# EAGLE design sensor_dsp (EAGLE 9.6.2)
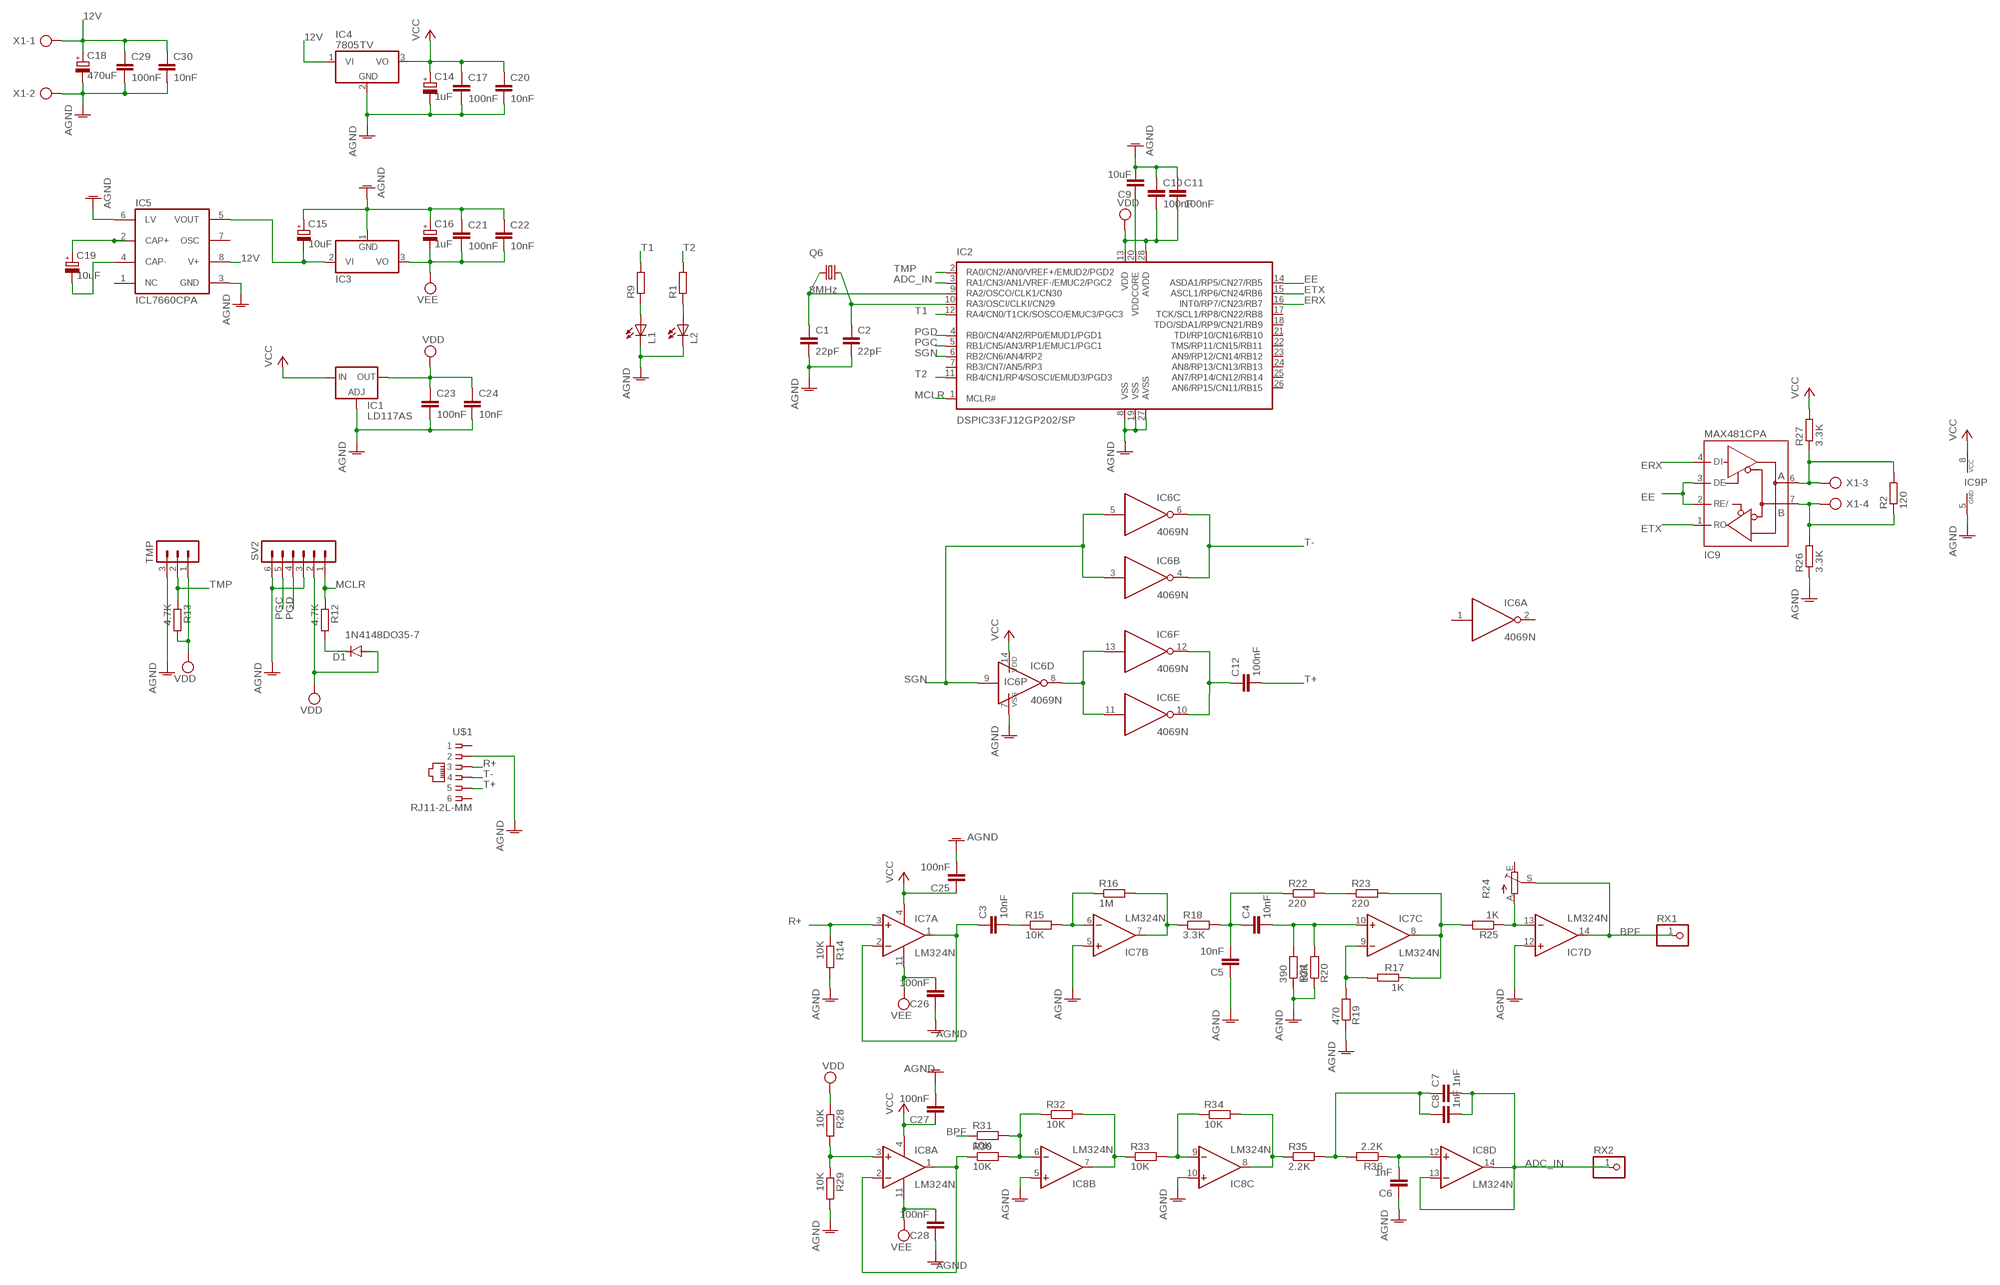
[diagram p0: schematic, sheet 1]

## Parts
C1  22pF  C-EU025-024X044  [C025-024X044]
C2  22pF  C-EU025-024X044  [C025-024X044]
C3  10nF  C5/2.5  [C5B2.5]
C4  10nF  C5/2.5  [C5B2.5]
C5  10nF  C5/2.5  [C5B2.5]
C6  1nF  C5/2.5  [C5B2.5]
C7  1nF  C5/2.5  [C5B2.5]
C8  1nF  C5/2.5  [C5B2.5]
C9  10uF  C-EU050-024X044  [C050-024X044]
C10  100nF  C5/2.5  [C5B2.5]
C11  100nF  C5/2.5  [C5B2.5]
C12  100nF  C5/2.5  [C5B2.5]
C14  1uF  CPOL-EUE2.5-5  [E2,5-5]
C15  10uF  CPOL-EUE2.5-5  [E2,5-5]
C16  1uF  CPOL-EUE2.5-5  [E2,5-5]
C17  100nF  C5/2.5  [C5B2.5]
C18  470uF  CPOL-EUE3.5-8  [E3,5-8]
C19  10uF  CPOL-EUE2.5-5  [E2,5-5]
C20  10nF  C5/2.5  [C5B2.5]
C21  100nF  C5/2.5  [C5B2.5]
C22  10nF  C5/2.5  [C5B2.5]
C23  100nF  C5/2.5  [C5B2.5]
C24  10nF  C5/2.5  [C5B2.5]
C25  100nF  C5/2.5  [C5B2.5]
C26  100nF  C5/2.5  [C5B2.5]
C27  100nF  C5/2.5  [C5B2.5]
C28  100nF  C5/2.5  [C5B2.5]
C29  100nF  C5/2.5  [C5B2.5]
C30  10nF  C5/2.5  [C5B2.5]
D1  1N4148DO35-7  [DO35-7]
IC1  LD117AS  LD117AS12TR  [SOT223]
IC2  DSPIC33FJ12GP202/SP  [DIL28-3]
IC3  79  [TO220V]
IC4  7805TV  [TO220V]
IC5  ICL7660CPA  [DIL08]
IC6  4069N  [DIL14]
IC7  LM324N  [DIL14]
IC8  LM324N  [DIL14]
IC9  MAX481CPA  [DIL08]
L1  LED3MM  [LED3MM]
L2  LED3MM  [LED3MM]
Q6  8MHz  CRYSTALSM49  [SM49]
R1  R-EU_0204/7  [0204/7]
R2  120  R-EU_0204/7  [0204/7]
R9  R-EU_0204/7  [0204/7]
R12  4.7K  R-EU_0204/7  [0204/7]
R13  4.7K  R-EU_0204/7  [0204/7]
R14  10K  R-EU_0204/7  [0204/7]
R15  10K  R-EU_0204/7  [0204/7]
R16  1M  R-EU_0204/7  [0204/7]
R17  1K  R-EU_0204/7  [0204/7]
R18  3.3K  R-EU_0204/7  [0204/7]
R19  470  R-EU_0204/7  [0204/7]
R20  10K  R-EU_0204/7  [0204/7]
R21  390  R-EU_0204/7  [0204/7]
R22  220  R-EU_0204/7  [0204/7]
R23  220  R-EU_0204/7  [0204/7]
R24  TRIM_EU-B64W  [B64W]
R25  1K  R-EU_0204/7  [0204/7]
R26  3.3K  R-EU_0204/7  [0204/7]
R27  3.3K  R-EU_0204/7  [0204/7]
R28  10K  R-EU_0204/7  [0204/7]
R29  10K  R-EU_0204/7  [0204/7]
R30  10K  R-EU_0204/7  [0204/7]
R31  10K  R-EU_0204/7  [0204/7]
R32  10K  R-EU_0204/7  [0204/7]
R33  10K  R-EU_0204/7  [0204/7]
R34  10K  R-EU_0204/7  [0204/7]
R35  2.2K  R-EU_0204/7  [0204/7]
R36  2.2K  R-EU_0204/7  [0204/7]
RX1  PINHD-1X1  [1X01]
RX2  PINHD-1X1  [1X01]
SV2  MA06-1  [MA06-1]
TMP  MA03-1  [MA03-1]
U$1  RJ11-2L-MM  [RJ11-NO_SHIELD_2]
X1  AK300/4  [AK300/4]

## Nets
12V: C18.+ C29.1 C30.1 IC4.1(VI) IC5.8(V+) X1.1
A: IC9.6(A) R2.2 R27.1 X1.3
ADC_IN: C7.2 C8.2 IC2.3(RA1/CN3/AN1/VREF-/EMUC2/PGC2) IC8.13(D:-IN) IC8.14(D:OUT) RX2.1
AGND: C1.2 C2.2 C5.1 C6.1 C9.2 C10.1 C11.1 C14.- C15.+ C16.+ C17.2 C18.- C20.2 C21.1 C22.1 C23.2 C24.2 C25.2 C26.1 C27.2 C28.1 C29.2 C30.2 IC1.1(ADJ) IC2.8(VSS) IC2.19(VSS) IC2.27(AVSS) IC3.1(GND) IC4.2(GND) IC5.3(GND) IC5.6(LV) IC6.7(P:VSS) IC7.5(B:+IN) IC7.12(D:+IN) IC8.5(B:+IN) IC8.10(C:+IN) IC9.5(GND) L1.K(C) L2.K(C) R14.2 R19.1 R20.1 R21.1 R26.1 R29.2 SV2.3 SV2.6 TMP.3 U$1.2 X1.2
B: IC9.7(B) R2.1 R26.2 X1.4
BPF: IC7.14(D:OUT) R24.S R31.1 RX1.1
EE: IC2.14(ASDA1/RP5/CN27/RB5) IC9.2(RE/) IC9.3(DE)
ERX: IC2.16(INT0/RP7/CN23/RB7) IC9.4(DI)
ETX: IC2.15(ASCL1/RP6/CN24/RB6) IC9.1(RO)
MCLR: IC2.1(MCLR#) R12.1 SV2.1
N$1: C9.1 IC2.20(VDDCORE)
N$2: C19.+ IC5.2(CAP+)
N$3: C15.- IC3.2(VI) IC5.5(VOUT)
N$4: C1.1 IC2.9(RA2/OSCO/CLK1/CN30) Q6.1
N$5: C19.- IC5.4(CAP-)
N$6: L1.A R9.1
N$7: C3.1 IC7.1(A:OUT) IC7.2(A:-IN)
N$8: C2.1 IC2.10(RA3/OSCI/CLKI/CN29) Q6.2
N$9: IC7.6(B:-IN) R15.2 R16.1
N$11: D1.C R12.2
N$12: IC6.8(D:O) IC6.11(E:I) IC6.13(F:I)
N$13: C12.1 IC6.10(E:O) IC6.12(F:O)
N$14: IC7.7(B:OUT) R16.2 R18.1
N$15: C3.2 R15.1
N$16: IC7.8(C:OUT) R17.1 R23.2 R25.2
N$17: IC7.9(C:-IN) R17.2 R19.2
N$18: C4.2 IC7.10(C:+IN) R20.2 R21.2
N$19: IC8.1(A:OUT) IC8.2(A:-IN) R30.1
N$20: C4.1 C5.2 R18.2 R22.1
N$21: R22.2 R23.1
N$22: IC7.13(D:-IN) R24.A R25.1
N$23: IC8.3(A:+IN) R28.2 R29.1
N$24: IC8.6(B:-IN) R30.2 R31.2 R32.1
N$25: IC8.7(B:OUT) R32.2 R33.1
N$26: IC8.9(C:-IN) R33.2 R34.1
N$27: IC8.8(C:OUT) R34.2 R35.1
N$28: L2.A R1.1
N$29: C7.1 C8.1 R35.2 R36.2
N$30: C6.2 IC8.12(D:+IN) R36.1
PGC: IC2.5(RB1/CN5/AN3/RP1/EMUC1/PGC1) SV2.5
PGD: IC2.4(RB0/CN4/AN2/RP0/EMUD1/PGD1) SV2.4
R+: IC7.3(A:+IN) R14.1 U$1.3
SGN: IC2.6(RB2/CN6/AN4/RP2) IC6.3(B:I) IC6.5(C:I) IC6.9(D:I)
T1: IC2.12(RA4/CN0/T1CK/SOSCO/EMUC3/PGC3) R9.2
T2: IC2.11(RB4/CN1/RP4/SOSCI/EMUD3/PGD3) R1.2
T+: C12.2 U$1.5
T-: IC6.4(B:O) IC6.6(C:O) U$1.4
TMP: IC2.2(RA0/CN2/AN0/VREF+/EMUD2/PGD2) R13.1 TMP.2
VCC: C14.+ C17.1 C20.1 C25.1 C27.1 IC1.3(IN) IC4.3(VO) IC6.14(P:VDD) IC7.4(P:V+) IC8.4(P:V+) IC9.8(VCC) R27.2
VDD: C10.2 C11.2 C23.1 C24.1 D1.A IC1.4(OUT) IC2.13(VDD) IC2.28(AVDD) R13.2 R28.1 SV2.2 TMP.1
VEE: C16.- C21.2 C22.2 C26.2 C28.2 IC3.3(VO) IC7.11(P:V-) IC8.11(P:V-)
Unconnected: IC2.7(RB3/CN7/AN5/RP3) IC2.17(TCK/SCL1/RP8/CN22/RB8) IC2.18(TDO/SDA1/RP9/CN21/RB9) IC2.21(TDI/RP10/CN16/RB10) IC2.22(TMS/RP11/CN15/RB11) IC2.23(AN9/RP12/CN14/RB12) IC2.24(AN8/RP13/CN13/RB13) IC2.25(AN7/RP14/CN12/RB14) IC2.26(AN6/RP15/CN11/RB15) IC5.1(NC) IC5.7(OSC) IC6.1(A:I) IC6.2(A:O) R24.E U$1.1 U$1.6

## Library data of the parts
C1 C2 C9 = rcl:C-EU: CAPACITOR, European symbol; SPICEPREFIX: C
C3-C8 C10-C12 C17 C20-C30 = capacitor-wima:C: CAPACITOR naming: grid - package width
C14-C16 C18 C19 = rcl:CPOL-EU: POLARIZED CAPACITOR, European symbol; SPICEPREFIX: C
D1 = diode:1N4148: DIODE high speed (Philips)
IC1 = v-reg:LD117A?*: Low drop fixed and adjustable positive voltage regulators 1 A Source: http://www.st.com/stonline/products/literature/ds/7194/ld1117axx.pdf
IC2 = microchip-dspic:DSPIC33FJ12GP202: dsPIC33 General DSC
IC3 = linear:79*: Negative VOLTAGE REGULATOR
IC4 = linear:78*: Positive VOLTAGE REGULATOR Source: http://cache.national.com/ds/LM/LM78L05.pdf http://www.fairchildsemi.com/ds/LM/LM7805.pdf
IC5 = maxim:ICL7660CPA: VOLTAGE CONVERTER; MF: INTERSIL; MPN: ICL7660CPA; OC_FARNELL: 1018170; OC_NEWARK: 06F7441
IC6 = 40xx:4069: Hex INVERTER
IC7 IC8 = linear:LM324: OP AMP
IC9 = maxim:MAX481CPA: RS485 TRANSEIVER; MPN: MAX481CPA+; OC_FARNELL: unknown; OC_NEWARK: 99K3445
L1 L2 = led:LED: LED OSRAM: - CHIPLED LG R971, LG N971, LY N971, LG Q971, LY Q971, LO R971, LY R971 LH N974, LH R974 LS Q976, LO Q976, LY Q976 LO Q996 - Hyper CHIPLED LW Q18S LB Q993, LB Q99A, LB R99A - SideLED LS A670, LO A670, LY A670, LG A670, LP A670 LB A673, LV A673, LT A673, LW A673 LH A674 LY A675 LS A676, LA A676, LO A676, LY A676, LW A676 LS A679, LY A679, LG A679 - Hyper Micro SIDELED® LS Y876, LA Y876, LO Y876, LY Y876 LT Y87S - SmartLED LW L88C, LW L88S LB L89C, LB L89S, LG L890 LS L89K, LO L89K, LY L89K LS L896, LA L896, LO L896, LY L896 - TOPLED LS T670, LO T670, LY T670, LG T670, LP T670 LSG T670, LSP T670, LSY T670, LOP T670, LYG T670 LG T671, LOG T671, LSG T671 LB T673, LV T673, LT T673, LW T673 LH T674 LS T676, LA T676, LO T676, LY T676, LB T676, LH T676, LSB T676, LW T676 LB T67C, LV T67C, LT T67C, LS T67K, LO T67K, LY T67K, LW E67C LS E67B, LA E67B, LO E67B, LY E67B, LB E67C, LV E67C, LT E67C LW T67C LS T679, LY T679, LG T679 LS T770, LO T770, LY T770, LG T770, LP T770 LB T773, LV T773, LT T773, LW T773 LH T774 LS E675, LA E675, LY E675, LS T675 LS T776, LA T776, LO T776, LY T776, LB T776 LHGB T686 LT T68C, LB T68C - Hyper Mini TOPLED® LB M676 - Mini TOPLED Santana® LG M470 LS M47K, LO M47K, LY M47K Source: http://www.osram.convergy.de LUXEON: - LUMILED® LXK2-PW12-R00, LXK2-PW12-S00, LXK2-PW14-U00, LXK2-PW14-V00 LXK2-PM12-R00, LXK2-PM12-S00, LXK2-PM14-U00 LXK2-PE12-Q00, LXK2-PE12-R00, LXK2-PE12-S00, LXK2-PE14-T00, LXK2-PE14-U00 LXK2-PB12-K00, LXK2-PB12-L00, LXK2-PB12-M00, LXK2-PB14-N00, LXK2-PB14-P00, LXK2-PB14-Q00 LXK2-PR12-L00, LXK2-PR12-M00, LXK2-PR14-Q00, LXK2-PR14-R00 LXK2-PD12-Q00, LXK2-PD12-R00, LXK2-PD12-S00 LXK2-PH12-R00, LXK2-PH12-S00 LXK2-PL12-P00, LXK2-PL12-Q00, LXK2-PL12-R00 Source: www.luxeon.com KINGBRIGHT: KA-3528ASYC Source: www.kingbright.com
Q6 = crystal:CRYSTAL: CRYSTAL; OC_FARNELL: unknown; OC_NEWARK: unknown
R1 R2 R9 R12 R13 R15-R17 R19-R23 R25-R29 R31-R36 = rcl:R-EU_: RESISTOR, European symbol; SPICEPREFIX: R
R14 R30 = rcl:R-EU_: RESISTOR, European symbol
R18 = resistor:R-EU_: RESISTOR, European symbol
R24 = pot:TRIM_EU-: POTENTIOMETER
RX1 RX2 = pinhead:PINHD-1X1: PIN HEADER
SV2 = con-lstb:MA06-1: PIN HEADER; OC_FARNELL: unknown; OC_NEWARK: unknown
TMP = con-lstb:MA03-1: PIN HEADER; OC_FARNELL: unknown; OC_NEWARK: unknown
U$1 = RJ11_RSA:RJ11-2L-MM
X1 = con-ptr500:AK300/4: CONNECTOR; OC_FARNELL: unknown; OC_NEWARK: unknown

## Board
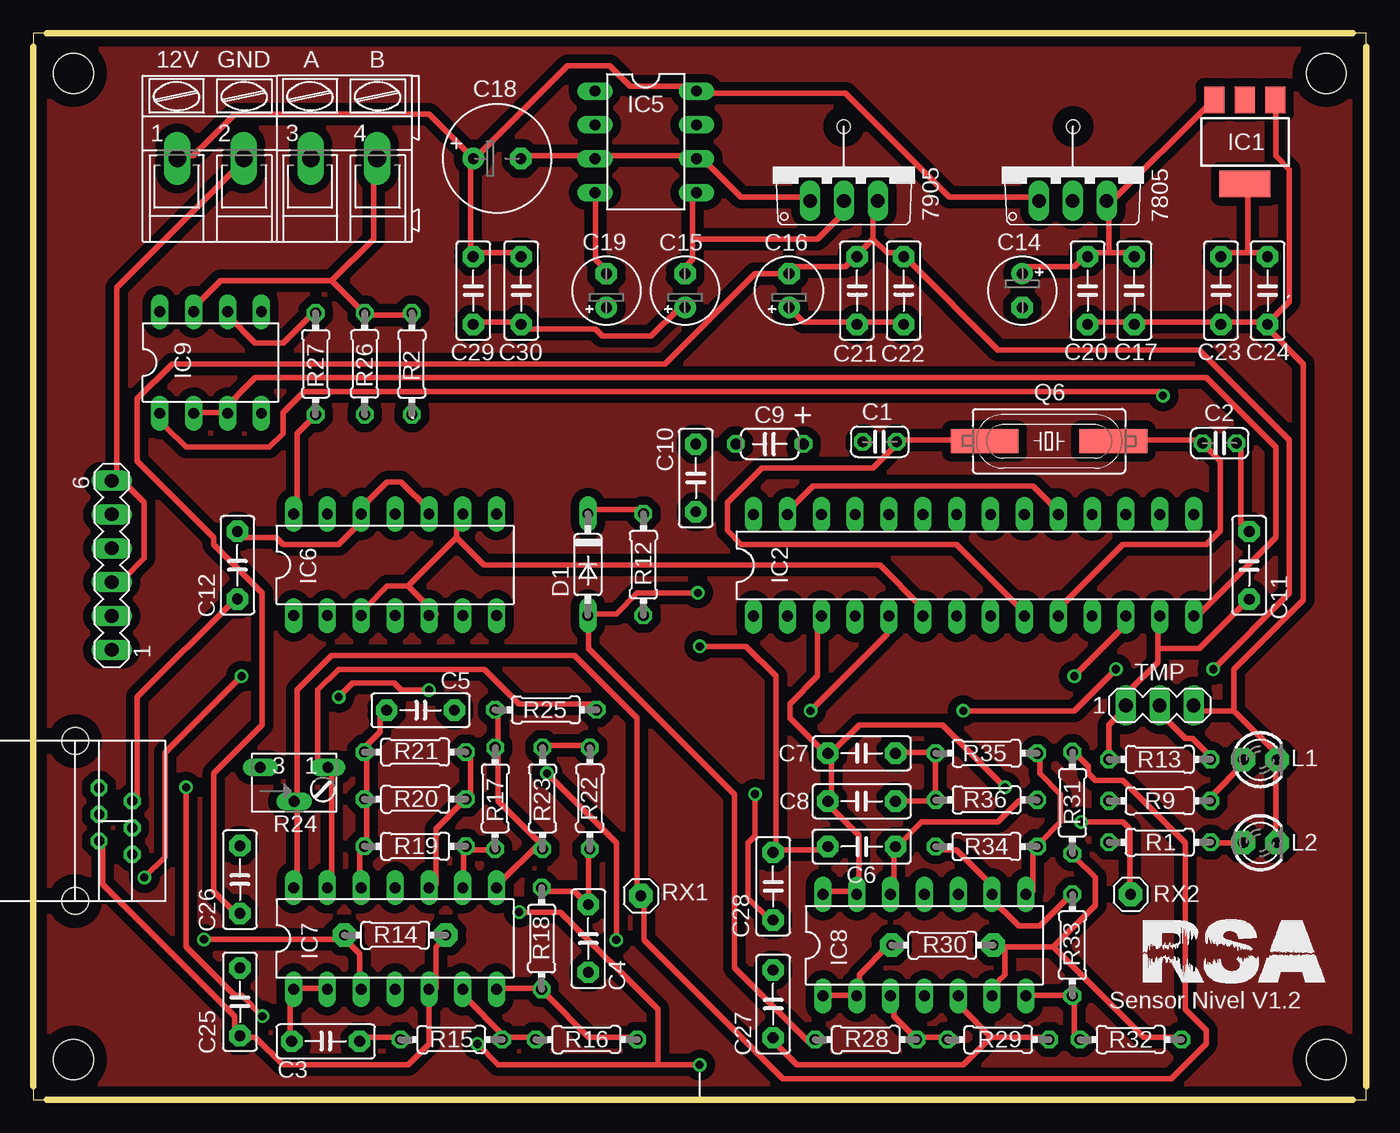
[diagram p1: board, top side]
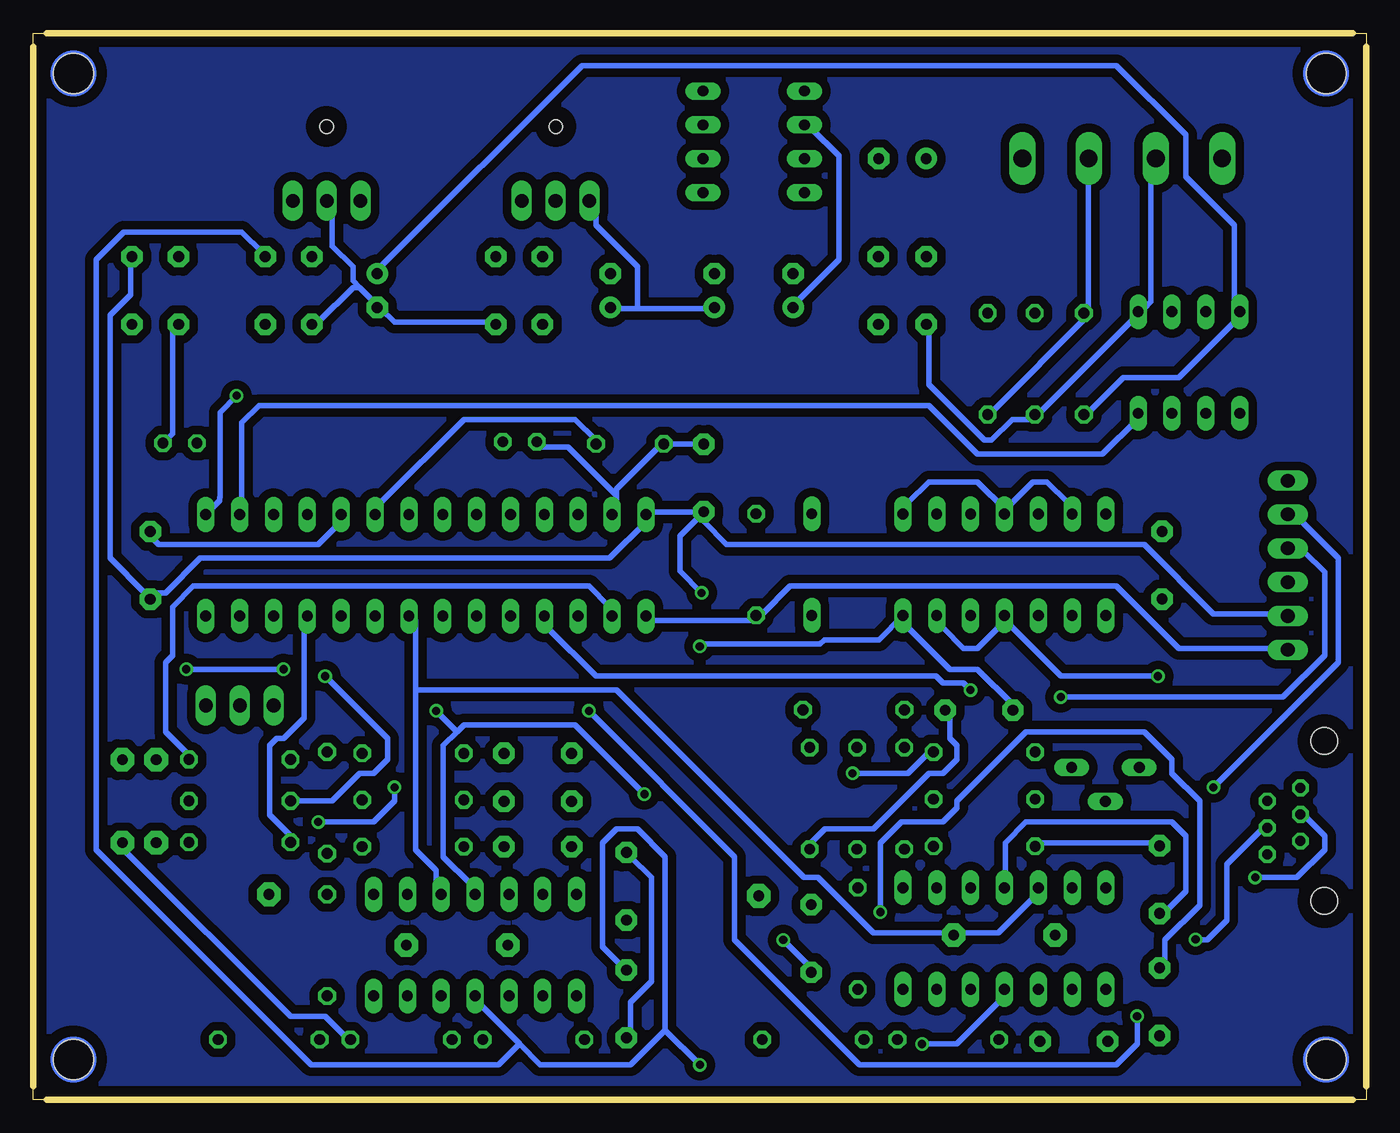
[diagram p2: board, bottom side, seen from below]

Size 100 x 80 mm. Coordinates in mm from the lower left corner, seen from the top.
Outline: 0,0 100,0 100,80 0,80 0,0
Copper layers (1*16): Top 0.035mm / dielectric 1.5mm / Bottom 0.035mm
Design rules "default *": minimum track width 16mil, minimum drill 24mil, track to track 25mil, track to pad 25mil, pad to pad 25mil, via to via 25mil, smd to smd 8mil, copper to edge 40mil, drill to drill 25mil, minimum pad ring 10mil, minimum via ring 8mil, stop-mask expansion 4mil, vias tented up to drill 0mil, thermal gap 10mil
Holes 3 mm at 3,77 97,77 97,3 3,3
Holes 1 mm at 60.8,73 78,73
Milling: 4 lines

### Footprints (pad centres in the part's own frame; a part is rotated, then mirrored left to right if it is on the bottom)
C025-024X044 = drill 0.813 octagon: 1 -1.27,0; 2 1.27,0
C5B2.5 = drill 0.813 pad 1.6 octagon: 1 -2.54,0; 2 2.54,0
C050-024X044 = drill 0.813 octagon: 1 -2.54,0; 2 2.54,0
E2,5-5 = drill 0.813 pad 1.6: + -1.27,0 | drill 0.813 pad 1.6 octagon: - 1.27,0
E3,5-8 = drill 0.813 pad 1.6: + -1.778,0 | drill 0.813 pad 1.6 octagon: - 1.778,0
DO35-7 = drill 0.813 long: A 3.81,0; C -3.81,0
SOT223 = smd 1.5 x 2: 1 -2.3,-3.15; 2 0,-3.15; 3 2.3,-3.15 | smd 3.8 x 2: 4 0,3.15
DIL28-3 = drill 0.813 long: 1 -16.51,-3.81; 2 -13.97,-3.81; 3 -11.43,-3.81; 4 -8.89,-3.81; 5 -6.35,-3.81; 6 -3.81,-3.81; 7 -1.27,-3.81; 8 1.27,-3.81; 9 3.81,-3.81; 10 6.35,-3.81; 11 8.89,-3.81; 12 11.43,-3.81; 13 13.97,-3.81; 14 16.51,-3.81; 15 16.51,3.81; 16 13.97,3.81; 17 11.43,3.81; 18 8.89,3.81; 19 6.35,3.81; 20 3.81,3.81; 21 1.27,3.81; 22 -1.27,3.81; 23 -3.81,3.81; 24 -6.35,3.81; 25 -8.89,3.81; 26 -11.43,3.81; 27 -13.97,3.81; 28 -16.51,3.81
TO220V = drill 1.016 long: 1 -2.54,-2.54; 2 0,-2.54; 3 2.54,-2.54
DIL08 = drill 0.813 long: 1 -3.81,-3.81; 2 -1.27,-3.81; 3 1.27,-3.81; 4 3.81,-3.81; 5 3.81,3.81; 6 1.27,3.81; 7 -1.27,3.81; 8 -3.81,3.81
DIL14 = drill 0.813 long: 1 -7.62,-3.81; 2 -5.08,-3.81; 3 -2.54,-3.81; 4 0,-3.81; 5 2.54,-3.81; 6 5.08,-3.81; 7 7.62,-3.81; 8 7.62,3.81; 9 5.08,3.81; 10 2.54,3.81; 11 0,3.81; 12 -2.54,3.81; 13 -5.08,3.81; 14 -7.62,3.81
LED3MM = drill 0.8 pad 1.778 octagon: A -1.27,0; K 1.27,0
SM49 = smd 5.08 x 1.778: 1 -4.826,0; 2 4.826,0
0204/7 = drill 0.813 octagon: 1 -3.81,0; 2 3.81,0
0204/7' = drill 0.8 pad 1.778 octagon: 1 -3.81,0; 2 3.81,0
B64W = drill 0.813 long: A 2.54,0; E -2.54,0; S 0,-2.54
1X01 = drill 0.8 pad 1.778 octagon: 1 0,0
MA06-1 = drill 1.016 long: 1 -6.35,0; 2 -3.81,0; 3 -1.27,0; 4 1.27,0; 5 3.81,0; 6 6.35,0
MA03-1 = drill 1.016 long: 1 -2.54,0; 2 0,0; 3 2.54,0
RJ11-NO_SHIELD_2 = drill 0.75 octagon: 1 -2.5,-7.3; 2 -1.5,-4.8; 3 -0.5,-7.3; 4 0.5,-4.8; 5 1.5,-7.3; 6 2.5,-4.8 | hole 2: -6,-3; 6,-3
AK300/4 = drill 1.321 long: 1 -7.493,0; 2 -2.515,0; 3 2.515,0; 4 7.493,0

### Placement (x,y rotation side)
C1  63.5,49.35 180 top
C2  89,49.25 0 top
C3  21.93,4.37 0 top
C4  41.63,12.08 270 top
C5  29.05,29.21 0 top
C6  62.15,18.98 0 top
C7  62.15,25.98 180 top
C8  62.15,22.38 180 top
C9  55.24,49.19 180 top
C10  49.7,46.63 270 top
C11  91.22,40.08 270 top
C12  15.31,40.09 270 top
C14  74.2,60.7 270 top
C15  48.9,60.7 90 top
C16  56.7,60.7 90 top
C17  82.6,60.7 270 top
C18  34.79,70.6 0 top
C19  43,60.7 90 top
C20  79.1,60.7 270 top
C21  61.8,60.7 90 top
C22  65.3,60.7 90 top
C23  89.1,60.7 270 top
C24  92.6,60.7 270 top
C25  15.5,7.33 270 top
C26  15.5,16.5 270 top
C27  55.5,7.17 270 top
C28  55.5,16 270 top
C29  33,60.7 270 top
C30  36.6,60.7 270 top
D1  41.6,40.13 270 top
IC1  90.9,71.86 180 top
IC2  70.55,40.08 0 top
IC3  60.82,69.98 0 top
IC4  77.99,69.98 0 top
IC5  45.95,71.86 270 top
IC6  27.14,40.12 0 top
IC7  27.14,12.08 0 top
IC8  66.86,11.58 0 top
IC9  13.3,55.3 0 top
L1  92.05,25.5 0 top
L2  92.05,19.27 0 top
Q6  76.2,49.4 0 top
R1  84.51,19.3 180 top
R2  28.4,55.2 270 top
R9  84.51,22.41 180 top
R12  45.77,40.13 90 top
R13  84.51,25.52 180 top
R14  10K  [0204/7']  27.15,12.33 0 top
R15  31.36,4.5 0 top
R16  41.5,4.5 0 top
R17  34.65,22.6 270 top
R18  38.14,12.08 90 top
R19  28.65,19 0 top
R20  28.65,22.54 0 top
R21  28.65,26.07 0 top
R22  41.75,22.6 90 top
R23  38.2,22.6 270 top
R24  19.57,24.92 0 top
R25  38.45,29.24 180 top
R26  24.86,55.2 90 top
R27  21.18,55.2 270 top
R28  62.46,4.5 0 top
R29  72.4,4.5 0 top
R30  10K  [0204/7']  68.21,11.58 0 top
R31  77.96,22.27 270 top
R32  82.33,4.5 180 top
R33  77.96,11.58 90 top
R34  71.52,18.98 0 top
R35  71.52,25.98 180 top
R36  71.52,22.48 180 top
RX1  45.58,15.29 0 top
RX2  82.33,15.4 0 top
SV2  5.88,40.09 90 top
TMP  84.51,29.57 0 top
U$1  0.13,20.89 90 top
X1  18.3,70.6 0 top

### Tracks (layer width: path | path; a pad name or v marks a point on that pad's centre or on a via)
12V
  Top 0.406: C30.1 36.45,63.52 33.33,63.52 C29.1 32.8,63.52 32.8,70.29 C18.+ | C18.+ 33.33,70.81 40.09,77.58 43.22,77.58 44.78,76.02 49.47,76.02 IC5.8 49.99,75.5 60.92,75.5 68.73,67.69 74.98,67.69 IC4.1 | X1.1 10.94,70.81 11.98,70.81 15.1,73.94 29.68,73.94 32.8,70.81 C18.+
A
  Top 0.406: IC9.6 14.58,58.84 16.66,56.76 18.75,56.76 20.83,58.84 R27.1
  Bottom 0.406: R2.2 28.12,51.55 20.83,58.84 R27.1 20.83,59.36 20.83,70.29 X1.3
ADC_IN  (via drill 0.61)
  Top 0.406: 61.44,15.62 61.94,15.62 61.94,19.81 59.88,21.87 C8.2 59.88,22.39 59.88,25.51 C7.2 | 61.44,15.62 59.36,15.62 IC8.14 | IC2.3 58.84,35.93 58.84,31.76 56.76,29.68 56.76,28.64 59.36,26.04 C7.2 | 61.44,15.62 IC8.13 | v78.63,20.83 81.75,20.83 82.27,20.31 82.27,15.62 RX2.1 | v72.9,23.43 68.21,28.12 61.96,28.12 59.88,26.04 C7.2
  Bottom 0.406: v78.63,20.83 74.46,20.83 72.9,22.39 v72.9,23.43
AGND  (via drill 0.61)
  Top 0.406: 90.08,29.16 87.48,29.16 TMP.3 | 90.08,29.16 93.73,25.51 L1.K 93.2,24.99 93.2,19.79 L2.K | 71.86,4.69 69.77,6.77 69.77,7.29 IC8.5 | 71.86,4.69 76.02,4.69 R29.2 | 55.72,18.75 59.36,18.75 C6.1 | 71.86,4.69 69.77,2.6 57.28,2.6 55.72,4.17 C27.2 | U$1.2 5.21,19.27 5.21,16.14 15.1,6.25 15.1,5.21 C25.2 15.62,4.69 16.66,4.69 18.75,2.6 28.12,2.6 29.68,4.17 29.68,7.81 IC7.5 30.2,8.33 30.2,11.46 30.72,11.98 R14.2 | IC7.12 24.47,16.14 24.47,18.75 R19.1 24.99,19.27 24.99,22.39 R20.1 24.99,22.91 24.99,26.04 R21.1 24.99,26.56 26.04,27.6 26.04,29.16 C5.1 | 55.72,18.75 55.72,31.76 53.48,34 v50,34 | 55.72,18.75 C28.1 | 6.25,46.86 8.33,44.78 8.33,40.62 6.77,39.05 6.25,39.05 SV2.3 | 6.25,46.86 6.25,60.92 15.62,70.29 X1.2 | 6.25,46.86 SV2.6 | C18.- 36.97,70.81 41.66,70.81 IC5.3 42.18,70.81 49.47,70.81 IC5.6 49.99,70.81 53.11,67.69 57.8,67.69 IC3.1 | C29.2 33.33,58.32 36.45,58.32 C30.2 36.97,57.8 42.18,57.8 42.7,57.28 46.34,57.28 48.42,59.36 C15.+ | C22.1 65.09,58.32 61.96,58.32 C21.1 61.44,58.32 57.8,58.32 56.76,59.36 C16.+ | C20.2 79.15,58.32 82.27,58.32 C17.2 82.79,58.32 89.04,58.32 C23.2 89.56,58.32 92.16,58.32 C24.2 | IC1.1 93.2,74.98 93.2,70.81 94.25,69.77 94.25,59.88 92.69,58.32 C24.2 | C2.2 90.6,48.95 90.6,43.22 91.12,42.7 C11.1 | 90.08,29.16 90.08,32.28 95.29,37.49 95.29,55.19 92.69,57.8 C24.2 | IC2.19 76.9,44.13 74.98,46.05 58.5,46.05 56.62,44.17 56.62,44.43 56.58,44.39 IC2.27
  Bottom 0.406: C27.2 55.19,4.69 55.19,7.29 53.63,8.85 53.63,16.66 55.19,18.22 C28.1 | L2.K 93.2,19.27 93.2,18.75 80.71,6.25 78.11,6.25 76.54,4.69 R29.2 | C5.1 26.56,29.68 29.16,32.28 31.24,32.28 34.37,35.41 34.37,35.93 IC6.7 36.57,34.5 40.65,34.5 40.98,34.17 49.83,34.17 v50,34 | 71.34,30.72 71.34,35.93 IC2.8 | 71.34,30.72 71.34,18.75 69.77,17.18 69.77,15.62 IC8.10 | C26.1 15.62,19.27 24.47,19.27 R19.1 | IC7.12 24.47,15.62 27.6,12.5 30.72,12.5 R14.2 31.24,12.5 36.97,12.5 41.13,16.66 42.18,16.66 56.24,30.72 71.34,30.72 | X1.2 16.14,70.29 16.14,59.88 16.66,59.36 IC9.5 17.18,58.84 24.47,51.55 R26.1 24.99,51.03 26.56,51.03 28.12,49.47 28.64,49.47 32.8,53.63 32.8,57.8 C29.2 | 54.67,59.36 56.24,59.36 C16.+ | 54.67,59.36 48.95,59.36 C15.+ | 54.67,59.36 54.67,62.48 57.8,65.61 57.8,67.17 IC3.1 | 75.5,60.92 74.46,59.88 C14.- 73.94,59.36 72.9,58.32 65.61,58.32 C22.1 | 75.5,60.92 76.02,61.44 76.02,62.48 77.58,64.05 77.58,67.17 IC4.2 | 75.5,60.92 76.02,60.92 78.63,58.32 C20.2 | 56.24,45.3 56.24,45.82 53.11,48.95 C9.2 49.72,49.19 C10.1 | 56.24,45.3 56.24,44.26 IC2.27 | 56.24,45.3 59.88,48.95 61.96,48.95 C1.2 | IC2.19 77.06,43.74 77.06,43.22 78.63,41.66 90.6,41.66 91.12,42.18 C11.1 | C23.2 89.56,57.8 89.56,49.99 90.08,49.47 C2.2
B
  Top 0.406: R2.1 28.12,58.84 24.99,58.84 R26.2 24.47,59.36 22.39,61.44 | 22.39,61.44 14.06,61.44 12.5,59.88 12.5,59.36 IC9.7 | 22.39,61.44 25.51,64.57 25.51,70.29 X1.4
BPF
  Top 0.406: IC7.14 19.79,16.14 19.79,21.87 R24.S 19.79,22.39 19.79,30.72 22.39,33.33 40.62,33.33 45.3,28.64 45.3,15.62 RX1.1 45.82,15.1 45.82,11.98 56.24,1.56 85.39,1.56 88,4.17 88,5.21 86.44,6.77 86.44,19.27 81.75,23.95 79.67,23.95 79.15,24.47 79.15,24.99 78.11,26.04 R31.1
EE
  Top 0.406: 14.06,51.55 12.5,51.55 IC9.2 | 14.06,51.55 16.66,54.15 88,54.15 93.2,48.95 93.2,42.18 87.48,36.45 IC2.14 | 14.06,51.55 IC9.3
ERX
  Bottom 0.406: IC2.16 84.35,44.26 84.35,50.78 83.06,52.07 32.8,52.07 29.16,48.42 19.79,48.42 17.18,51.03 IC9.4
ETX  (via drill 0.61)
  Top 0.406: IC9.1 9.89,51.03 9.89,50.51 11.46,48.95 17.7,48.95 18.75,49.99 18.75,51.55 20.31,53.11 84.44,53.11 v84.75,52.81
  Bottom 0.406: IC2.15 86.02,44.93 86.02,45.17 86,45.19 86,51.56 v84.75,52.81
MCLR
  Bottom 0.406: IC2.1 53.63,35.93 45.82,35.93 R12.1 45.3,36.45 43.22,38.53 18.75,38.53 14.06,33.85 6.25,33.85 SV2.1
MM1
  pour Top: 0,0 99.9,0 99.9,80 0,80
N$1
  Bottom 0.406: IC2.20 73.94,44.26 73.94,44.78 67.69,51.03 59.36,51.03 57.8,49.47 C9.1
N$2
  Bottom 0.406: IC5.2 41.66,72.9 39.57,70.81 39.57,63.01 42.7,59.88 C19.+
N$3
  Top 0.406: 49.47,64.57 49.47,63.01 48.95,62.48 C15.- | 49.47,64.57 49.47,67.69 IC5.5 | 49.47,64.57 58.84,64.57 60.4,66.13 60.4,67.17 IC3.2
N$4
  Top 0.406: IC2.9 73.94,36.45 73.94,36.97 69.25,41.66 53.11,41.66 52.07,42.7 52.07,44.78 54.67,47.38 63.01,47.38 64.57,48.95 C1.1 65.09,49.47 71.34,49.47 Q6.1
N$5
  Top 0.406: IC5.4 42.18,67.69 42.18,63.01 42.7,62.48 C19.-
N$6
  Top 0.406: R9.1 88.52,22.91 90.6,24.99 L1.A
N$7
  Top 0.406: IC7.2 21.87,8.33 19.79,8.33 IC7.1 19.27,7.81 19.27,4.69 C3.1
N$8
  Top 0.406: IC2.10 77.06,36.45 77.06,36.97 81.75,41.66 88,41.66 89.04,42.7 89.04,47.9 88,48.95 C2.1 87.48,49.47 81.23,49.47 Q6.2
N$9
  Top 0.406: 35.41,4.69 37.49,4.69 R16.1 | 35.41,4.69 32.28,7.81 IC7.6 | 35.41,4.69 R15.2
N$10
  pour Bottom: 0,80 100,80 100,0 0,0
N$11
  Top 0.406: D1.C 41.66,44.26 45.3,44.26 R12.2
N$12
  Bottom 0.406: 27.08,44.26 24.99,46.34 23.95,46.34 22.39,44.78 22.39,44.26 IC6.13 | 27.08,44.26 29.16,46.34 32.8,46.34 34.37,44.78 34.37,44.26 IC6.8 | 27.08,44.26 IC6.11
N$13
  Top 0.406: IC6.10 29.68,44.26 27.6,46.34 26.56,46.34 24.99,44.78 24.99,44.26 IC6.12 24.99,43.74 22.91,41.66 18.75,41.66 18.22,42.18 15.62,42.18 C12.1
N$14
  Top 0.406: IC7.7 34.89,8.33 38.01,8.33 R18.1 38.53,7.81 41.66,4.69 45.3,4.69 R16.2
N$15
  Top 0.406: R15.1 27.08,4.69 24.99,4.69 C3.2
N$16
  Top 0.406: R25.2 34.89,29.16 34.89,26.56 R17.1 34.89,26.04 34.89,22.39 38.01,19.27 | 38.01,19.27 34.89,16.14 IC7.8 | 38.01,19.27 R23.2
N$17
  Top 0.406: IC7.9 32.28,16.14 32.28,18.75 R19.2 32.8,18.75 34.37,18.75 R17.2
N$18  (via drill 0.61)
  Top 0.406: IC7.10 30.2,16.14 30.2,20.31 32.28,22.39 R20.2 32.8,22.91 32.8,26.04 R21.2 | v43.74,11.98 43.74,19.27 v38.53,24.47
  Bottom 0.406: v43.74,11.98 41.66,9.89 C4.2 | v38.53,24.47 34.37,24.47 32.8,26.04 R21.2
N$19
  Top 0.406: IC8.1 59.36,7.81 61.44,7.81 IC8.2 61.96,7.81 61.96,9.37 64.05,11.46 R30.1
N$20
  Top 0.406: R18.2 38.53,15.62 40.62,15.62 41.13,15.1 C4.1 41.66,15.1 41.66,18.75 R22.1
  Bottom 0.406: C5.2 31.24,29.16 31.24,27.08 30.72,26.56 30.72,25.51 31.76,24.47 32.8,24.47 36.97,20.31 40.62,20.31 41.66,19.27 R22.1
N$21
  Top 0.406: R23.1 38.53,26.56 41.66,26.56 R22.2
N$22
  Top 0.406: IC7.13 22.39,16.14 22.39,24.47 R24.A 21.87,24.99 21.35,25.51 21.35,30.72 22.91,32.28 33.85,32.28 36.45,29.68 42.18,29.68 R25.1
N$23
  Top 0.406: R29.1 68.21,4.69 66.65,4.69 R28.2 66.13,4.69 64.57,6.25 64.57,7.29 IC8.3
N$24
  Top 0.406: 76.54,11.46 83.31,4.69 85.92,4.69 R32.1 | 72.9,11.46 72.38,11.46 R30.2 72.9,11.46 | 72.9,11.46 76.54,11.46 | 72.9,11.46 72.9,9.37 72.38,8.85 72.38,7.81 IC8.6 | 76.54,11.46 79.67,14.58 79.67,16.66 78.11,18.22 R31.2
N$25
  Top 0.406: IC8.7 74.98,7.81 77.58,7.81 R33.1 78.11,7.29 78.11,4.69 R32.2
N$26
  Top 0.406: R34.1 68.21,18.75 69.25,18.75 71.86,16.14 71.86,15.62 IC8.9 71.86,15.1 73.94,13.02 75.5,13.02 77.58,15.1 R33.2
N$27
  Top 0.406: IC8.8 74.98,15.62 74.98,18.75 R34.2 75.5,19.27 77.06,20.83 77.06,22.91 75.5,24.47 75.5,25.51 R35.1
N$28
  Top 0.406: R1.1 88.52,19.27 90.6,19.27 L2.A
N$29
  Top 0.406: C8.1 65.09,22.39 67.69,22.39 R36.2 67.69,22.91 67.69,25.51 R35.2 67.69,26.04 65.09,26.04 C7.1
N$30
  Top 0.406: IC8.12 64.57,15.62 64.57,18.75 C6.2 65.09,19.27 66.65,20.83 72.38,20.83 73.94,22.39 74.98,22.39 R36.1
PGC  (via drill 0.61)
  Top 0.406: v58.32,29.16 64.05,34.89 64.05,35.93 IC2.5 | v17.18,6.25 15.62,7.81 15.1,7.81 11.46,11.46 v11.46,23.43
  Bottom 0.406: v58.32,29.16 47.38,18.22 47.38,11.98 38.01,2.6 18.75,2.6 17.18,4.17 v17.18,6.25 | v11.46,23.43 2.08,32.8 2.08,40.62 5.73,44.26 SV2.5
PGD  (via drill 0.61)
  Top 0.406: v29.68,30.72 27.6,30.72 27.08,31.24 23.95,31.24 v22.91,30.2
  Bottom 0.406: v29.68,30.72 30.2,31.24 31.76,31.24 32.28,31.76 57.8,31.76 61.44,35.41 61.44,35.93 IC2.4 | v22.91,30.2 6.25,30.2 3.12,33.33 3.12,39.57 4.69,41.13 5.73,41.13 SV2.4
R+  (via drill 0.61)
  Top 0.406: IC7.3 24.47,8.33 24.47,10.94 23.43,11.98 R14.1 23.02,12.01 v12.8,12.01
  Bottom 0.406: U$1.3 7.81,20.31 10.46,17.66 10.46,13.46 11.91,12 12.5,12 12.51,12.01 v12.8,12.01
SGN
  Top 0.406: 28.12,38.53 26.56,38.53 24.99,36.97 24.99,36.45 IC6.3 | 28.12,38.53 30.2,36.45 IC6.5 | 31.76,42.18 31.76,43.74 IC6.9 | 28.12,38.53 31.76,42.18 | 31.76,42.18 33.83,40.12 63.51,40.12 66.65,36.97 66.65,36.45 IC2.6
T1  (via drill 0.61)
  Top 0.406: v78.11,31.76 82.27,35.93 IC2.12
  Bottom 0.406: v78.11,31.76 73.42,27.08 73.42,25.51 74.46,24.47 75.5,24.47 77.58,22.39 80.19,22.39 R9.2
T2
  Bottom 0.406: IC2.11 79.67,35.93 79.67,28.64 81.23,27.08 81.75,27.08 82.27,26.56 82.27,21.35 80.71,19.79 R1.2
T+
  Top 0.406: U$1.5 7.81,22.39 7.81,30.2 15.1,37.49 C12.2
T-  (via drill 0.61)
  Top 0.406: v8.33,16.66 9.89,18.22 9.89,26.04 v15.62,31.76
  Bottom 0.406: v8.33,16.66 5.21,16.66 3.12,18.75 3.12,19.79 4.69,21.35 U$1.4 | v15.62,31.76 22.91,31.76 27.08,35.93 | 27.08,35.93 29.16,33.85 30.2,33.85 31.76,35.41 31.76,35.93 IC6.6 | 27.08,35.93 IC6.4
TMP
  Top 0.406: R13.1 88,26.04 86.96,27.08 86.44,27.08 84.35,29.16 TMP.2
  Bottom 0.406: IC2.2 56.76,36.45 56.76,36.97 58.32,38.53 88,38.53 89.56,36.97 89.56,33.33 90.08,32.8 90.08,27.6 88.52,26.04 R13.1
VCC  (via drill 0.61)
  Top 0.406: v33.33,4.17 34.89,2.6 46.86,2.6 | v49.99,2.6 46.86,2.6 | v36.45,14.06 39.57,14.06 46.86,6.77 46.86,2.6 | IC6.14 19.79,44.26 19.79,49.99 20.83,51.03 R27.2 | C14.+ 74.46,62.48 78.11,62.48 78.63,63.01 C20.1 79.15,63.52 80.71,63.52 | 80.71,63.52 82.27,63.52 C17.1 | 80.71,67.17 88.52,74.98 IC1.3 | 80.71,67.17 80.71,63.52 | 80.71,67.17 IC4.3
  Bottom 0.406: 63.52,4.17 61.96,2.6 55.19,2.6 52.59,5.21 | 63.52,4.17 66.65,7.29 IC8.4 | 52.59,5.21 52.59,18.22 54.67,20.31 56.24,20.31 57.28,19.27 57.28,11.46 55.72,9.89 C27.1 | v33.33,4.17 30.72,4.17 27.6,7.29 27.6,7.81 IC7.4 | 52.59,5.21 v49.99,2.6 | v36.45,14.06 36.45,19.27 34.89,20.83 31.76,20.83 30.72,21.87 30.72,22.39 25.51,27.6 16.66,27.6 14.58,25.51 14.58,24.47 12.5,22.39 12.5,14.58 15.1,11.98 15.1,9.89 C25.1 | R27.2 20.83,51.55 18.22,54.15 14.06,54.15 9.89,58.32 9.89,58.84 IC9.8 9.89,59.36 9.89,65.61 13.54,69.25 13.54,72.38 18.75,77.58 58.84,77.58 73.94,62.48 C14.+ | 63.52,4.17 65.09,2.6 79.15,2.6 95.29,18.75 95.29,63.01 93.2,65.09 84.35,65.09 82.79,63.52 C17.1
VDD  (via drill 0.61)
  Top 0.406: 91.12,63.52 92.16,63.52 C24.1 | 91.12,63.52 89.56,63.52 C23.1 | 91.12,63.52 91.12,68.21 IC1.4 | R13.2 80.71,26.04 80.71,28.12 81.75,29.16 TMP.1 82.27,29.68 82.27,30.72 84.35,32.8 84.35,33.85 | 84.35,33.85 84.35,35.93 IC2.13 | 84.35,33.85 87.48,33.85 91.12,37.49 C11.2 | R28.1 58.32,4.17 52.59,9.89 52.59,22.91 41.66,33.85 41.66,35.93 D1.A 41.66,36.45 43.74,36.45 45.3,38.01 v49.86,38.01
  Bottom 0.406: C24.1 92.69,63.01 92.69,60.4 94.25,58.84 94.25,40.62 91.64,38.01 C11.2 91.12,38.01 90.08,38.01 87.48,40.62 56.76,40.62 54.04,43.33 IC2.28 53.84,44.09 C10.2 | SV2.2 6.25,36.45 11.46,36.45 16.66,41.66 48,41.66 49.7,43.36 C10.2 | v49.86,38.01 51.5,39.65 51.5,42.3 C10.2
VEE  (via drill 0.61)
  Top 0.406: v54.15,22.91 54.15,19.79 53.63,19.27 53.63,15.1 55.19,13.54 C28.2 | 63.01,64.57 63.01,67.17 IC3.3 | 63.01,64.57 61.96,63.52 C21.2 61.44,63.01 60.92,62.48 56.76,62.48 C16.- 56.24,61.96 54.15,61.96 47.38,55.19 10.41,55.19 7.81,52.59 7.81,47.9 13.54,42.18 13.54,41.66 17.18,38.01 17.18,28.12 13.54,24.47 13.54,15.62 15.1,14.06 C26.2 | 63.01,64.57 64.05,63.52 65.09,63.52 C22.2 65.61,63.01 72.38,56.24 87.48,56.24 94.25,49.47 94.25,38.01 v88.52,32.28 | v69.77,29.16 78.11,29.16 v81.23,32.28
  Bottom 0.406: 68.21,27.6 67.69,28.12 59.36,28.12 v54.15,22.91 | 68.21,27.6 69.25,26.56 69.25,18.22 67.17,16.14 67.17,15.62 IC8.11 | IC7.11 27.08,16.14 27.08,19.27 25.51,20.83 14.58,20.83 13.54,19.79 13.54,15.62 15.1,14.06 C26.2 | v69.77,29.16 68.21,27.6 | v88.52,32.28 v81.23,32.28
(copper drawn outside any net)
  shapes: Bottom circle x4

### Text on the board
tPlace: Sensor Nivel V1.2
tNames: 12V | GND | A | B | 7905 | 7805 | +